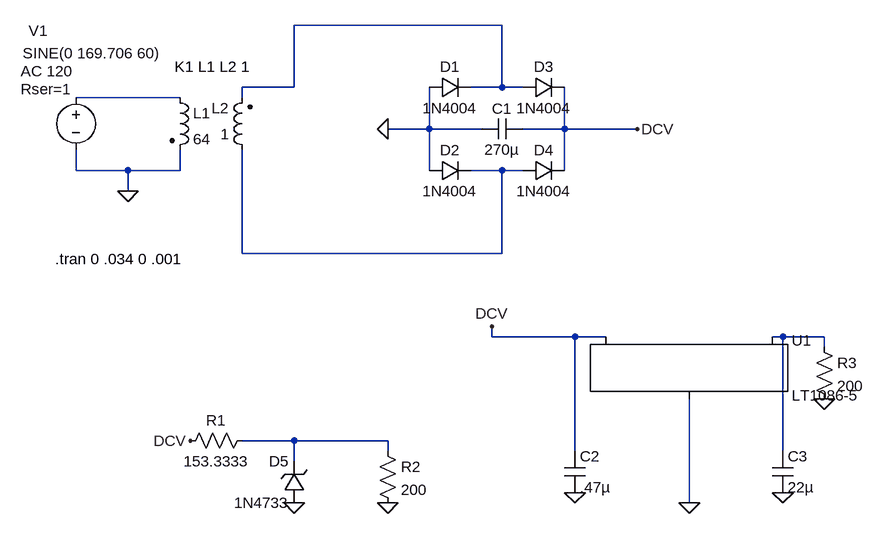
[diagram p0: schematic ltspice.asc]
ltspice.asc, the LTspice schematic file:
Version 4
SHEET 1 880 884
WIRE 160 64 -160 64
WIRE -160 160 -160 64
WIRE -160 160 -240 160
WIRE 160 160 160 64
WIRE 160 160 112 160
WIRE 192 160 160 160
WIRE -336 176 -496 176
WIRE -240 176 -240 160
WIRE 48 224 48 160
WIRE 48 224 -16 224
WIRE 128 224 48 224
WIRE 256 224 256 160
WIRE 256 224 192 224
WIRE 368 224 256 224
WIRE -496 288 -496 256
WIRE -416 288 -496 288
WIRE -336 288 -336 256
WIRE -336 288 -416 288
WIRE 48 288 48 224
WIRE 160 288 112 288
WIRE 192 288 160 288
WIRE 256 288 256 224
WIRE -416 320 -416 288
WIRE -240 416 -240 256
WIRE 160 416 160 288
WIRE 160 416 -240 416
WIRE 144 544 144 528
WIRE 272 544 144 544
WIRE 320 544 272 544
WIRE 592 544 576 544
WIRE 656 544 592 544
WIRE 656 560 656 544
WIRE -160 704 -240 704
WIRE -16 704 -160 704
WIRE -16 720 -16 704
WIRE 272 720 272 544
WIRE 592 720 592 544
WIRE -160 736 -160 704
WIRE 448 800 448 640
FLAG -16 224 0
FLAG 368 224 DCV
FLAG -416 320 0
FLAG -320 704 DCV
FLAG -160 800 0
FLAG -16 800 0
FLAG 448 800 0
FLAG 144 528 DCV
FLAG 656 640 0
FLAG 272 784 0
FLAG 592 784 0
SYMBOL diode 48 176 R270
WINDOW 0 32 32 VTop 2
WINDOW 3 0 32 VBottom 2
SYMATTR InstName D1
SYMATTR Value 1N4004
SYMBOL diode 48 304 R270
WINDOW 0 32 32 VTop 2
WINDOW 3 0 32 VBottom 2
SYMATTR InstName D2
SYMATTR Value 1N4004
SYMBOL diode 192 176 R270
WINDOW 0 32 32 VTop 2
WINDOW 3 0 32 VBottom 2
SYMATTR InstName D3
SYMATTR Value 1N4004
SYMBOL diode 192 304 R270
WINDOW 0 32 32 VTop 2
WINDOW 3 0 32 VBottom 2
SYMATTR InstName D4
SYMATTR Value 1N4004
SYMBOL voltage -496 160 R0
WINDOW 0 -73 -87 Left 2
WINDOW 3 -82 -53 Left 2
WINDOW 123 -85 -25 Left 2
WINDOW 39 -85 3 Left 2
SYMATTR InstName V1
SYMATTR Value SINE(0 169.706 60)
SYMATTR Value2 AC 120
SYMATTR SpiceLine Rser=1
SYMBOL ind2 -352 160 R0
SYMATTR InstName L1
SYMATTR Value 64
SYMATTR Type ind
SYMBOL ind2 -224 272 R180
WINDOW 0 36 80 Left 2
WINDOW 3 36 40 Left 2
SYMATTR InstName L2
SYMATTR Value 1
SYMATTR Type ind
SYMATTR SpiceLine Rser=16.68
SYMBOL cap 192 208 R90
WINDOW 0 0 32 VBottom 2
WINDOW 3 32 32 VTop 2
SYMATTR InstName C1
SYMATTR Value 270µ
SYMBOL res -336 720 R270
WINDOW 0 32 56 VTop 2
WINDOW 3 0 56 VBottom 2
SYMATTR InstName R1
SYMATTR Value 153.3333
SYMBOL zener -144 800 R180
WINDOW 0 24 64 Left 2
WINDOW 3 24 0 Left 2
SYMATTR InstName D5
SYMATTR Value 1N4733
SYMBOL res -32 704 R0
SYMATTR InstName R2
SYMATTR Value 200
SYMBOL cap 256 720 R0
SYMATTR InstName C2
SYMATTR Value .47µ
SYMBOL cap 576 720 R0
SYMATTR InstName C3
SYMATTR Value 22µ
SYMBOL PowerProducts\\LT1086-5 448 544 R0
SYMATTR InstName U1
SYMBOL res 640 544 R0
SYMATTR InstName R3
SYMATTR Value 200
TEXT -344 128 Left 2 !K1 L1 L2 1
TEXT -528 424 Left 2 !.tran 0 .034 0 .001

The netlist it stands for:
* ltspice.asc
D1 0 N001 1N4004
D2 0 N003 1N4004
D3 N001 DCV 1N4004
D4 N003 DCV 1N4004
V1 N002 0 SINE(0 169.706 60) AC 120 Rser=1
L1 N002 0 64
L2 N003 N001 1 Rser=16.68
C1 DCV 0 270µ
R1 DCV N005 153.3333
D5 0 N005 1N4733
R2 N005 0 200
C2 DCV 0 .47µ
C3 N004 0 22µ
XU1 0 N004 DCV LT1086-5
R3 N004 0 200
.model D D
.lib standard.dio
K1 L1 L2 1
.tran 0 .034 0 .001
.backanno
.end